# EAGLE design riser-1u-ssr-2x (EAGLE 4.16)
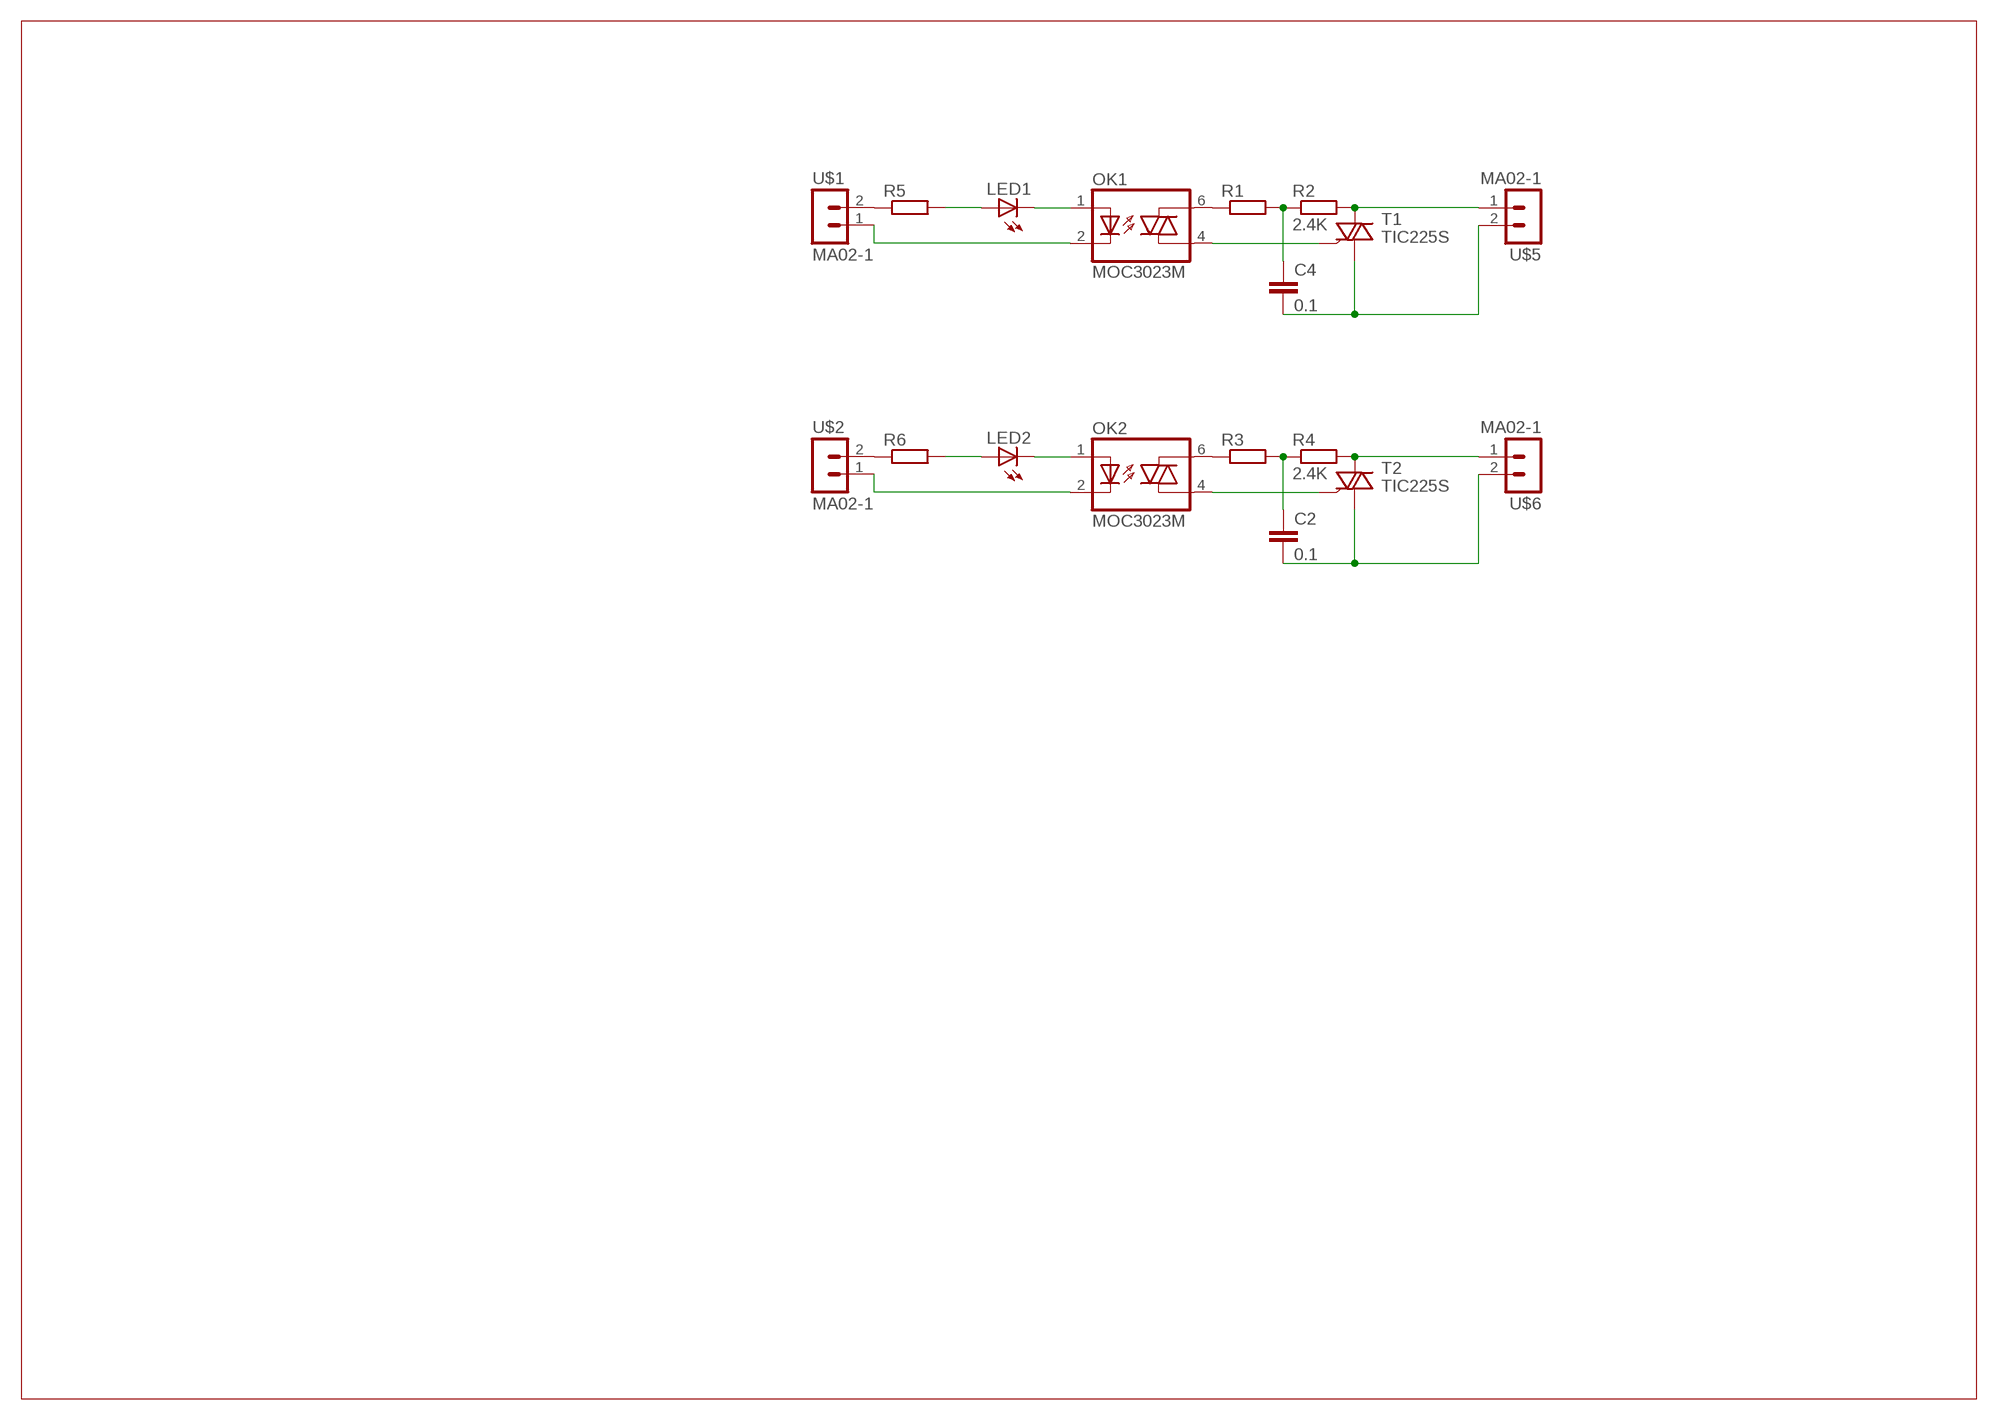
[diagram p0: schematic, sheet 1]

## Parts
C2  0.1  C-EU150-054X183  [C150-054X183]
C4  0.1  C-EU150-054X183  [C150-054X183]
LED1  LED3MM  [LED3MM]
LED2  LED3MM  [LED3MM]
OK1  MOC3023M  [DIL06]
OK2  MOC3023M  [DIL06]
R1  R-EU_0207/2V  [0207/2V]
R2  2.4K  R-EU_0207/15  [0207/15]
R3  R-EU_0207/2V  [0207/2V]
R4  2.4K  R-EU_0207/15  [0207/15]
R5  R-EU_0207/2V  [0207/2V]
R6  R-EU_0207/2V  [0207/2V]
T1  TIC225S  [TO220DS]
T2  TIC225S  [TO220DS]
U$1  MA02-1  [MA02-1]
U$2  MA02-1  [MA02-1]
U$5  MA02-1  [MA02-1]
U$6  MA02-1  [MA02-1]

## Nets
N$1: C4.1 R1.2 R2.1
N$2: OK1.6(A2) R1.1
N$3: OK2.6(A2) R3.1
N$4: C2.1 R3.2 R4.1
N$5: R2.2 T1.A2 U$5.1
N$6: OK1.4(A1) T1.G
N$7: R4.2 T2.A2 U$6.1
N$8: OK2.4(A1) T2.G
N$9: C4.2 T1.A1 U$5.2
N$10: C2.2 T2.A1 U$6.2
N$11: R5.1 U$1.2
N$12: R6.1 U$2.2
N$13: OK1.2(C) U$1.1
N$14: LED1.A R5.2
N$15: LED1.K(C) OK1.1(A)
N$16: LED2.A R6.2
N$17: LED2.K(C) OK2.1(A)
N$18: OK2.2(C) U$2.1

## Library data of the parts
C2 C4 = rcl:C-EU: CAPACITOR, European symbol
LED1 LED2 = led:LED: LED OSRAM: - CHIPLED LG R971, LG N971, LY N971, LG Q971, LY Q971, LO R971, LY R971 LH N974, LH R974 LS Q976, LO Q976, LY Q976 LO Q996 - Hyper CHIPLED LW Q18S LB Q993, LB Q99A, LB R99A - SideLED LS A670, LO A670, LY A670, LG A670, LP A670 LB A673, LV A673, LT A673, LW A673 LH A674 LY A675 LS A676, LA A676, LO A676, LY A676, LW A676 LS A679, LY A679, LG A679 - Hyper Micro SIDELED® LS Y876, LA Y876, LO Y876, LY Y876 LT Y87S - SmartLED LW L88C, LW L88S LB L89C, LB L89S, LG L890 LS L89K, LO L89K, LY L89K LS L896, LA L896, LO L896, LY L896 - TOPLED LS T670, LO T670, LY T670, LG T670, LP T670 LSG T670, LSP T670, LSY T670, LOP T670, LYG T670 LG T671, LOG T671, LSG T671 LB T673, LV T673, LT T673, LW T673 LH T674 LS T676, LA T676, LO T676, LY T676, LB T676, LH T676, LSB T676, LW T676 LB T67C, LV T67C, LT T67C, LS T67K, LO T67K, LY T67K, LW E67C LS E67B, LA E67B, LO E67B, LY E67B, LB E67C, LV E67C, LT E67C LW T67C LS T679, LY T679, LG T679 LS T770, LO T770, LY T770, LG T770, LP T770 LB T773, LV T773, LT T773, LW T773 LH T774 LS E675, LA E675, LY E675, LS T675 LS T776, LA T776, LO T776, LY T776, LB T776 LHGB T686 LT T68C, LB T68C - Hyper Mini TOPLED® LB M676 - Mini TOPLED Santana® LG M470 LS M47K, LO M47K, LY M47K Source: http://www.osram.convergy.de - LUMILED® LXK2-PW12-R00, LXK2-PW12-S00, LXK2-PW14-U00, LXK2-PW14-V00 LXK2-PM12-R00, LXK2-PM12-S00, LXK2-PM14-U00 LXK2-PE12-Q00, LXK2-PE12-R00, LXK2-PE12-S00, LXK2-PE14-T00, LXK2-PE14-U00 LXK2-PB12-K00, LXK2-PB12-L00, LXK2-PB12-M00, LXK2-PB14-N00, LXK2-PB14-P00, LXK2-PB14-Q00 LXK2-PR12-L00, LXK2-PR12-M00, LXK2-PR14-Q00, LXK2-PR14-R00 LXK2-PD12-Q00, LXK2-PD12-R00, LXK2-PD12-S00 LXK2-PH12-R00, LXK2-PH12-S00 LXK2-PL12-P00, LXK2-PL12-Q00, LXK2-PL12-R00 Source: www.luxeon.com
OK1 OK2 = optocoupler:MOC30*M: RANDOM-PHASE OPTOISOLATORS TRIAC DRIVER OUTPUT Source: http://www.fairchildsemi.com MOC3020-M.pdf
R1-R6 = rcl:R-EU_: RESISTOR, European symbol
T1 T2 = cls:TIC225S: TRIAC
U$1 U$2 U$5 U$6 = cls:MA02-1

## Board
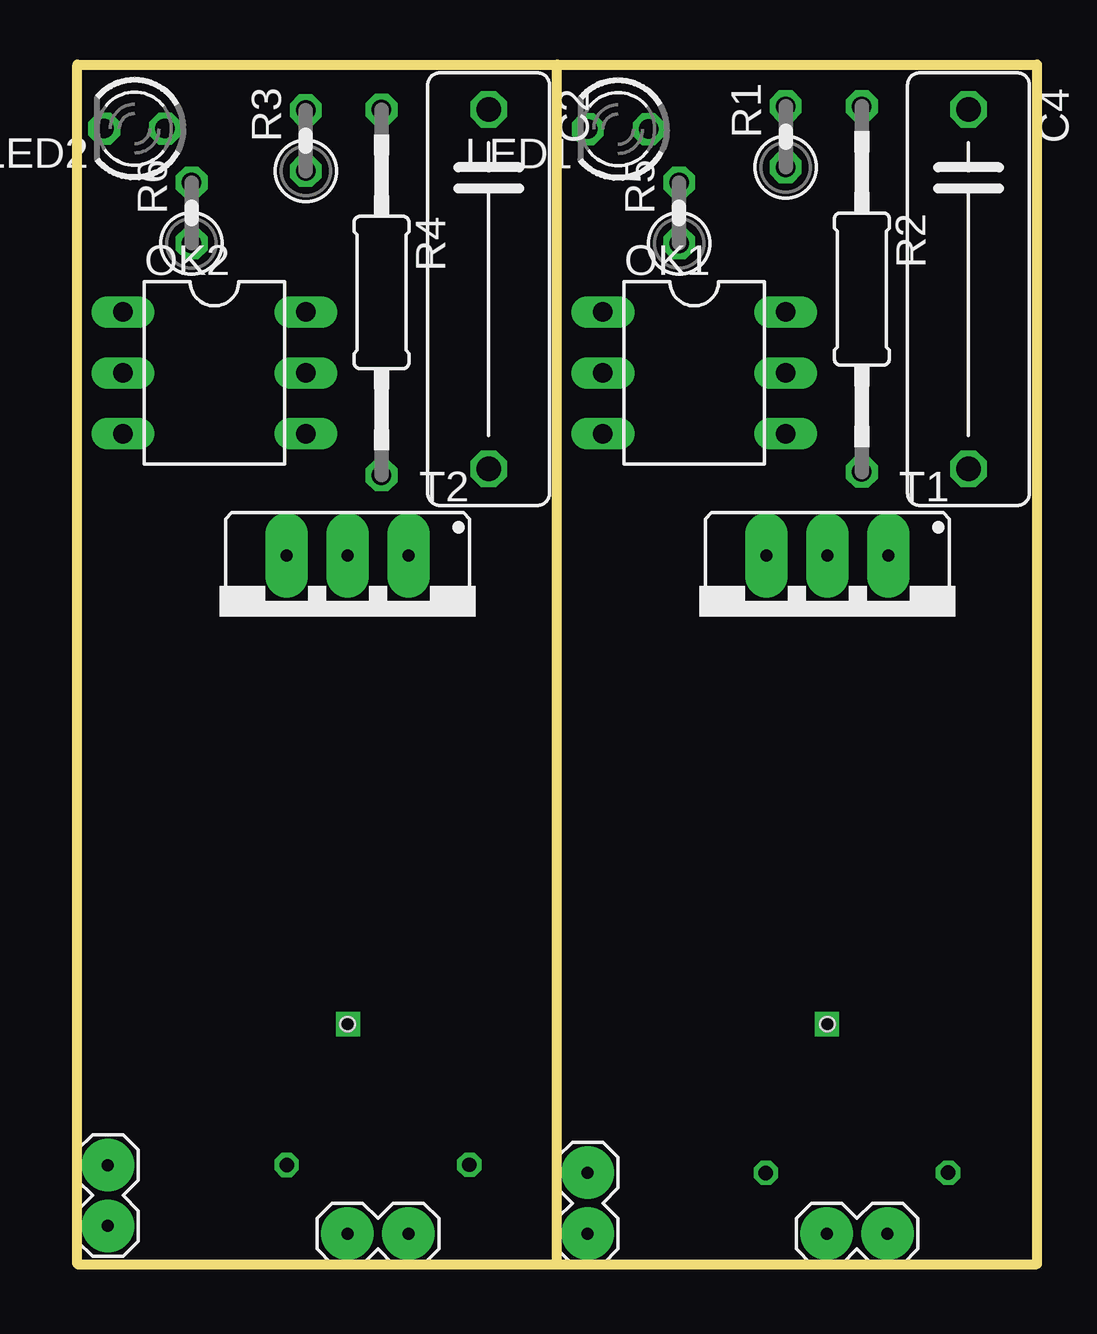
[diagram p1: board, top side]
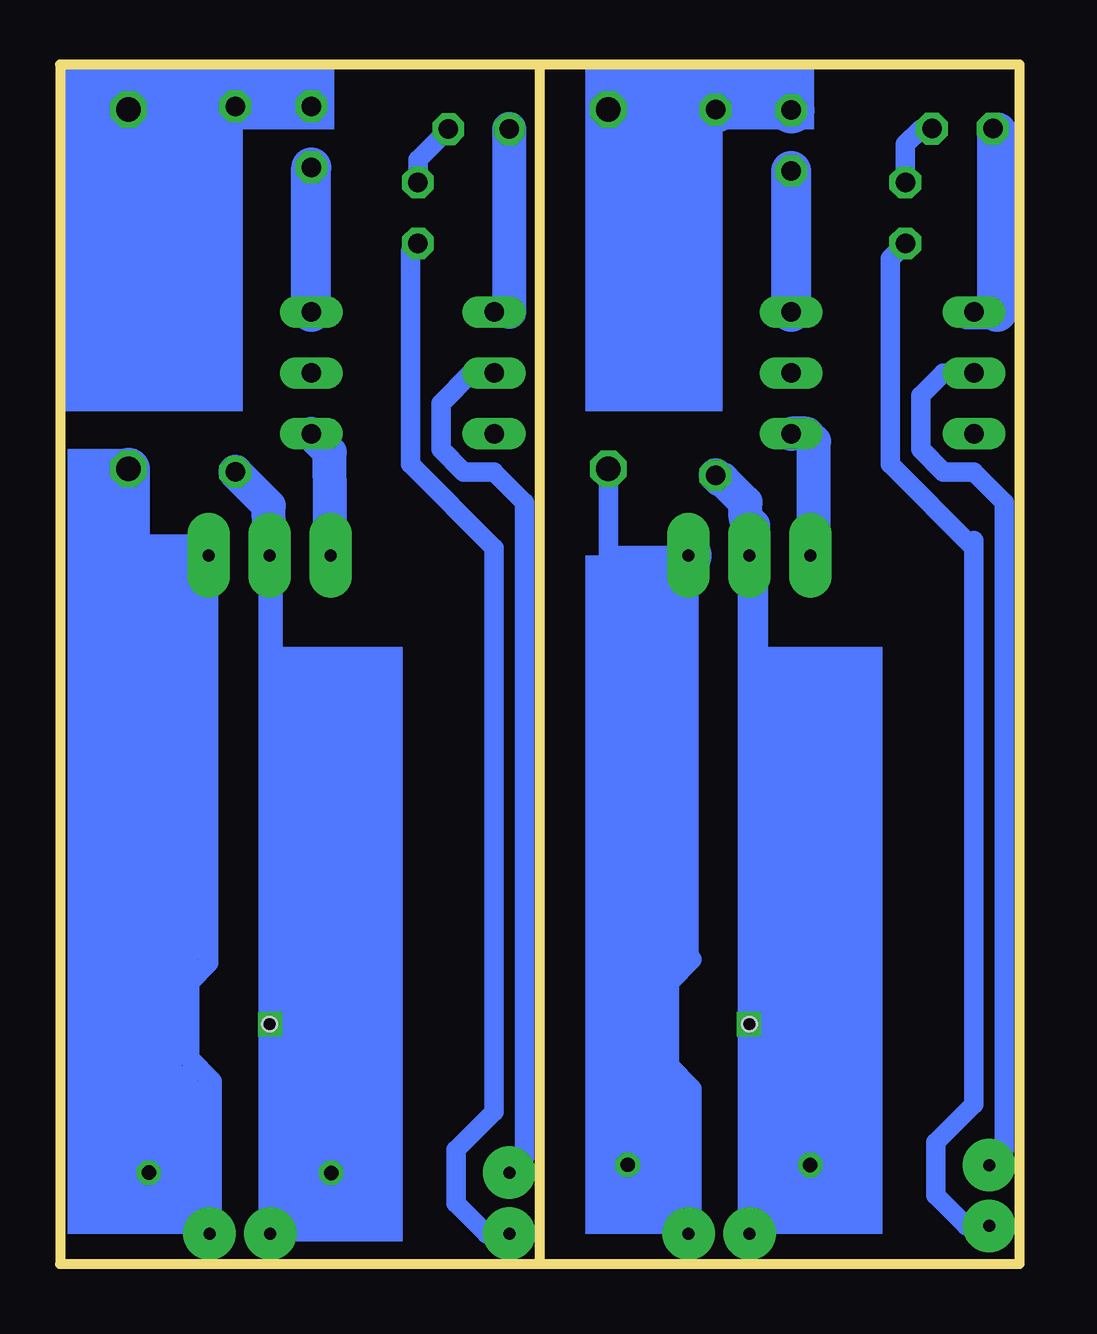
[diagram p2: board, bottom side, seen from below]

Size 40.01 x 50 mm. Coordinates in mm from the lower left corner, seen from the top.
Outline: 20,50 0,50 0,0 20,0
Outline: 20,50 40,50 40,0
Outline: 20,0 40.01,0
Outline: 20,0 20,50 20,50
Copper layers (1*16): Top 0.035mm / dielectric 1.5mm / Bottom 0.035mm
Design rules "default": minimum track width 10mil, minimum drill 24mil, track to track 8mil, track to pad 8mil, pad to pad 8mil, via to via 8mil, smd to smd 8mil, copper to edge 40mil, drill to drill 8mil, minimum pad ring 10mil, minimum via ring 8mil, stop-mask expansion 4mil, vias tented up to drill 0mil, thermal gap 10mil
Holes 0.6 mm at 11.27,10 31.27,10

### Footprints (pad centres in the part's own frame; a part is rotated, then mirrored left to right if it is on the bottom)
C150-054X183 = drill 1.016 octagon: 1 -7.493,0; 2 7.493,0
LED3MM = drill 0.813 octagon: A -1.27,0; K 1.27,0
DIL06 = drill 0.813 long: 1 -2.54,-3.81; 2 0,-3.81; 3 2.54,-3.81; 4 2.54,3.81; 5 0,3.81; 6 -2.54,3.81
0207/2V = drill 0.813 octagon: 1 -1.27,0; 2 1.27,0
0207/15 = drill 0.813 octagon: 1 -7.62,0; 2 7.62,0
TO220DS = drill 0.5 pad 1.778 long: A1 -2.54,-2.54; A2 0,-2.54; G 2.54,-2.54
MA02-1 = drill 0.5 pad 2.184 round: 1 -1.27,0; 2 1.27,0

### Placement (x,y rotation side)
C2  17.14,40.64 270 top
C4  37.15,40.64 270 top
LED1  22.54,47.31 180 top
LED2  2.39,47.33 180 top
OK1  25.72,37.15 270 top
OK2  5.71,37.15 270 top
R1  29.53,46.99 90 top
R2  32.7,40.64 270 top
R3  9.52,46.83 90 top
R4  12.68,40.5 270 top
R5  25.08,43.81 90 top
R6  4.76,43.81 90 top
T1  31.27,27 180 top
T2  11.27,27 180 top
U$1  21.27,2.54 270 top
U$2  1.27,2.86 270 top
U$5  32.51,1.27 0 top
U$6  12.53,1.27 0 top

### Tracks (layer width: path | path; a pad name or v marks a point on that pad's centre or on a via)
N$1
  Bottom 1.676: R1.2 R2.1 37.15,48.26 C4.1
N$2
  Bottom 1.676: OK1.6 R1.1
N$3
  Bottom 0.813: 9.53,45.72 R3.1
  Bottom 1.676: OK2.6 R3.1
N$4
  Bottom 1.93: C2.1 17.02,48.26 12.7,48.26 12.7,48.14 R4.1 12.54,48.26 9.68,48.26 R3.2
N$5
  Bottom 0.61: U$5.1
  Bottom 1.016: U$5.1 31.23,29.5
  Bottom 1.422: R2.2 31.3,31.61 T1.A2 31.23,29.5 | U$5.1
N$6
  Bottom 1.422: T1.G 28.76,33.84 OK1.4
N$7  (via drill 0.6)
  Bottom 1.27: v8.73,4.13 11.11,4.13 11.11,1.27 | U$6.1 11.11,1.27 | T2.A2 11.11,29.54 11.11,1.27
  Bottom 1.422: T2.A2 11.11,29.7 11.11,30.8 11.43,31.11 11.43,31.75 12.38,32.7 12.5,32.7 R4.2
  Bottom 1.676: 11.27,29.56 T2.A2 | U$6.1
N$8
  Bottom 1.422: T2.G 8.57,29.7 8.57,34.29 8.89,34.61 OK2.4
N$9
  Bottom 0.61: 33.81,1.3 33.8,1.31
  Bottom 0.813: 33.8,1.31 33.66,1.46 33.66,7.62 34.61,8.57 34.61,11.75 33.8,12.55 T1.A1 | T1.A1 | T1.A1
  Bottom 1.422: U$5.2 33.81,1.3
  Bottom 1.778: T1.A1 37.13,29.54 37.15,29.53 C4.2
N$10
  Bottom 0.813: 13.82,29.53 17.14,29.53 C2.2 | U$6.2 13.65,1.28 13.65,7.3 14.61,8.26 14.61,11.75 13.65,12.7 13.78,12.83 13.78,29.54 T2.A1
  Bottom 1.676: T2.A1 | U$6.2
  Bottom 1.93: T2.A1 13.82,29.53
N$11
  Bottom 0.813: U$1.2 22.23,1.27 23.5,2.54 23.5,4.76 21.91,6.35 21.91,29.84 25.4,33.34 25.4,42.23 R5.1
N$12
  Bottom 0.813: U$2.2 2.22,1.59 3.49,2.86 3.49,5.08 1.91,6.67 1.91,29.84 | 1.91,30.16 1.91,29.84 | 1.91,29.84 5.4,33.34 5.4,41.91 R6.1
N$13
  Bottom 0.813: U$1.1 20.64,4.45 20.64,31.75 21.91,33.02 23.18,33.02 24.13,33.97 24.13,35.88 22.86,37.15 OK1.2
N$14
  Bottom 0.813: R5.2 25.08,46.04 LED1.A
N$15
  Bottom 0.813: OK1.1 21.27,39.69
  Bottom 1.422: 21.27,39.69 LED1.K
N$16
  Bottom 0.813: LED2.A 3.68,47.31 4.13,47.31 4.76,46.67 R6.2
N$17
  Bottom 0.813: LED2.K 0.95,47.16 | OK2.1 2.22,39.37 1.27,39.37 0.95,39.69
  Bottom 1.676: 0.95,47.16 0.95,39.69
N$18
  Bottom 0.813: U$2.1 0.64,4.76 0.64,31.75 1.91,33.02 3.17,33.02 4.13,33.97 4.13,36.2 3.17,37.15 OK2.2
N$19  (via drill 0.6)
  other vias: 16.34,4.14
N$20  (via drill 0.6)
  other vias: 28.7,3.8
N$21  (via drill 0.6)
  other vias: 36.3,3.81
N$22  (via drill 0.6)
  other vias: 11.29,10
N$23  (via drill 0.6)
  other vias: 31.24,10
(copper drawn outside any net)
  shapes: Bottom area x15

### Text on the board
Dimension: 15 | 15-100mil
tOrigins: 1.27 | 12.53 | 21.27 | 32.53